# EAGLE design H&M_CD (EAGLE 9.6.0)
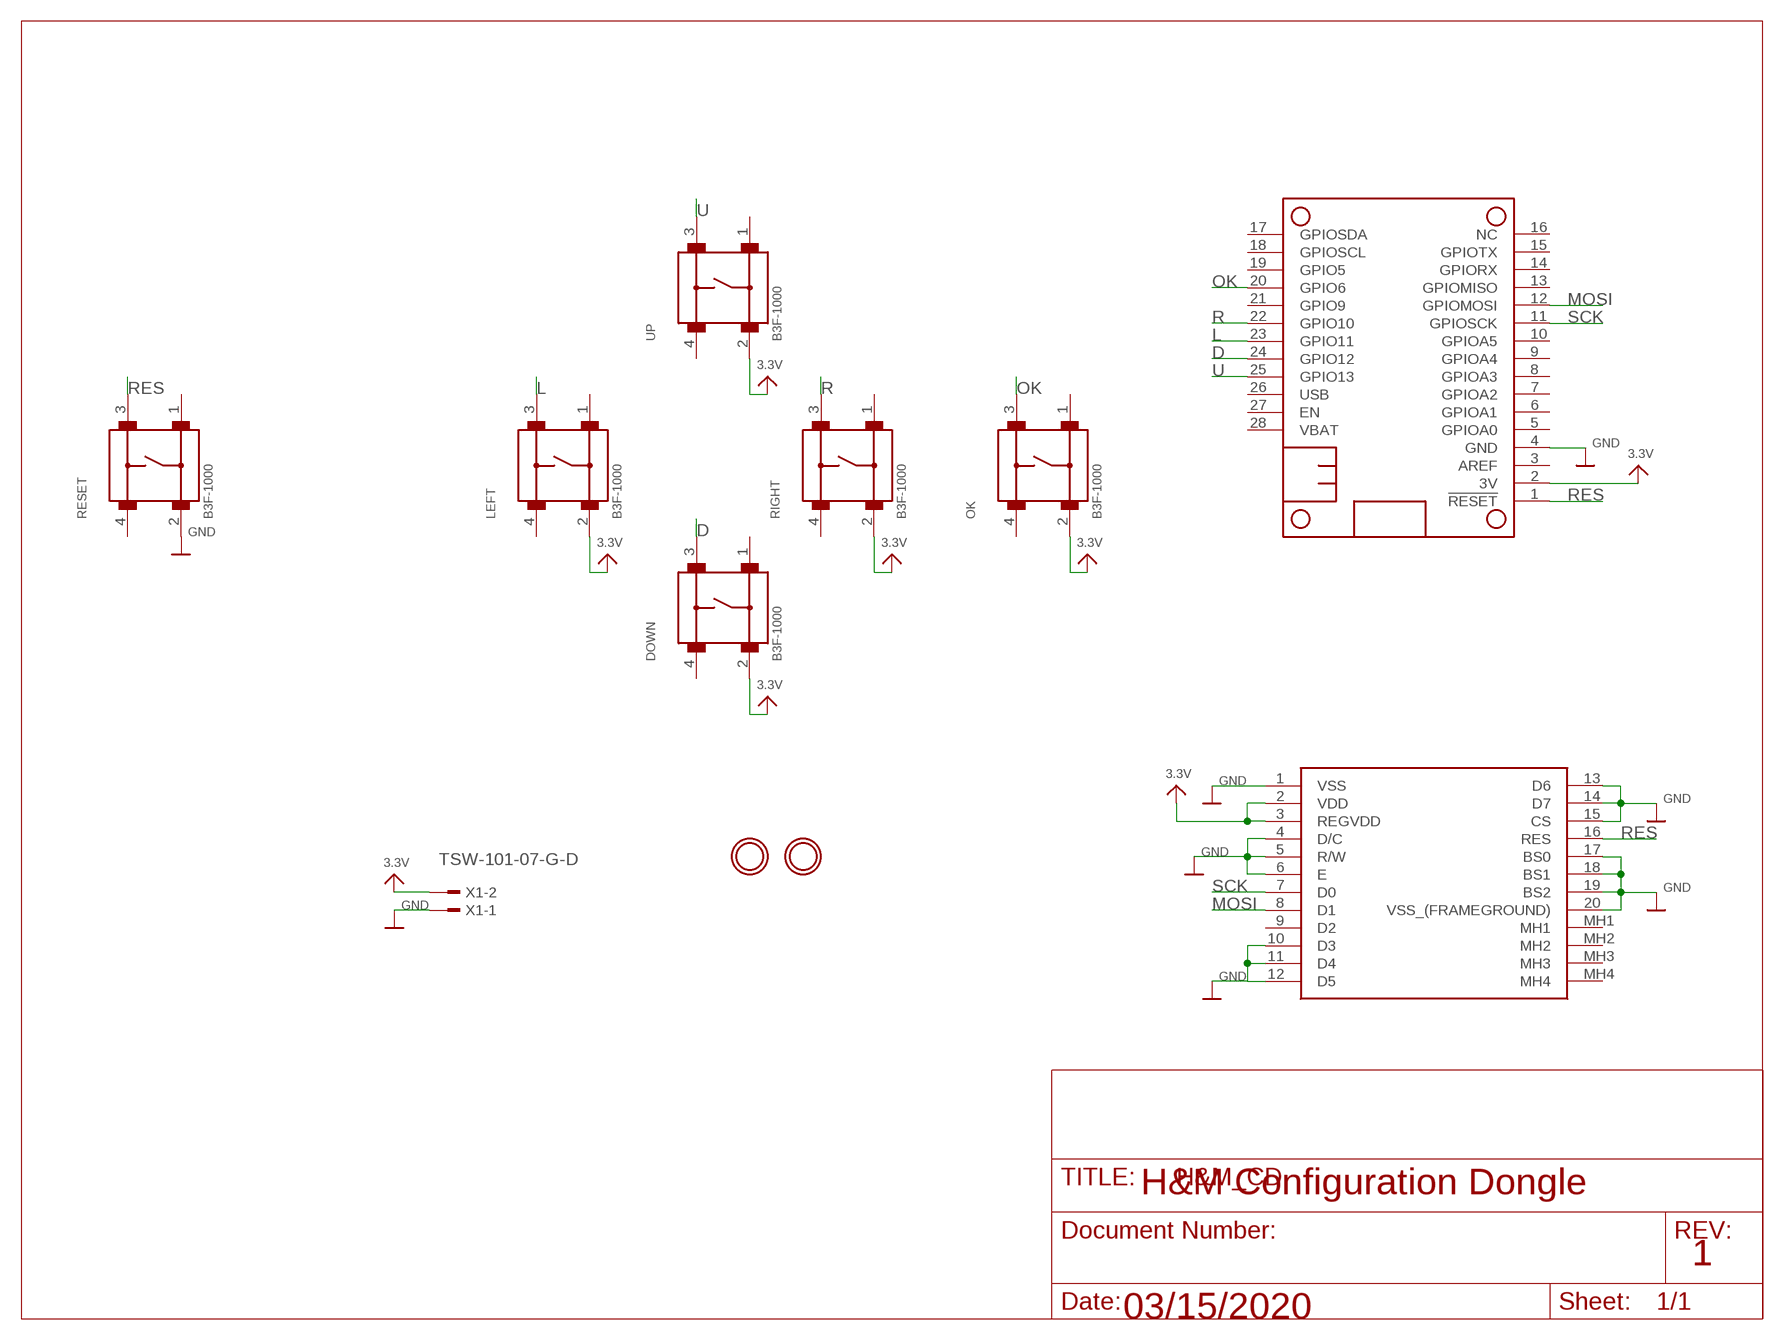
[diagram p0: schematic, sheet 1]

## Parts
20X4OLED  NHD-0420CW-AW3  [NHD0420CWAW3]
ATSAMD21M0  FEATHERWING_NODIM  [FEATHERWING_DIM]
DOWN  B3F-1000  [B3F-1000]
LEFT  B3F-1000  [B3F-1000]
OK  B3F-1000  [B3F-1000]
RESET  B3F-1000  [B3F-1000]
RIGHT  B3F-1000  [B3F-1000]
U$15  MOUNTINGHOLE2.5  [MOUNTINGHOLE_2.5_PLATED]
U$16  MOUNTINGHOLE2.5  [MOUNTINGHOLE_2.5_PLATED]
UP  B3F-1000  [B3F-1000]
X1  TSW-101-07-G-D  [TSW-101-XX-G-D]

## Nets
3.3V: 20X4OLED.2(VDD) 20X4OLED.3(REGVDD) ATSAMD21M0.2(3V) DOWN.2 LEFT.2 OK.2 RIGHT.2 UP.2 X1.2
D: ATSAMD21M0.24(GPIO12) DOWN.3
GND: 20X4OLED.1(VSS) 20X4OLED.4(D/C) 20X4OLED.5(R/W) 20X4OLED.6(E) 20X4OLED.10(D3) 20X4OLED.11(D4) 20X4OLED.12(D5) 20X4OLED.13(D6) 20X4OLED.14(D7) 20X4OLED.15(CS) 20X4OLED.17(BS0) 20X4OLED.18(BS1) 20X4OLED.19(BS2) 20X4OLED.20(VSS_(FRAMEGROUND)) ATSAMD21M0.4(GND) RESET.2 X1.1
L: ATSAMD21M0.23(GPIO11) LEFT.3
MOSI: 20X4OLED.8(D1) ATSAMD21M0.12(GPIOMOSI)
OK: ATSAMD21M0.20(GPIO6) OK.3
R: ATSAMD21M0.22(GPIO10) RIGHT.3
RES: 20X4OLED.16(RES) ATSAMD21M0.1(!RESET) RESET.3
SCK: 20X4OLED.7(D0) ATSAMD21M0.11(GPIOSCK)
U: ATSAMD21M0.25(GPIO13) UP.3
Unconnected: 20X4OLED.9(D2) 20X4OLED.MH1 20X4OLED.MH2 20X4OLED.MH3 20X4OLED.MH4 ATSAMD21M0.3(AREF) ATSAMD21M0.5(GPIOA0) ATSAMD21M0.6(GPIOA1) ATSAMD21M0.7(GPIOA2) ATSAMD21M0.8(GPIOA3) ATSAMD21M0.9(GPIOA4) ATSAMD21M0.10(GPIOA5) ATSAMD21M0.13(GPIOMISO) ATSAMD21M0.14(GPIORX) ATSAMD21M0.15(GPIOTX) ATSAMD21M0.16(NC) ATSAMD21M0.17(GPIOSDA) ATSAMD21M0.18(GPIOSCL) ATSAMD21M0.19(GPIO5) ATSAMD21M0.21(GPIO9) ATSAMD21M0.26(USB) ATSAMD21M0.27(EN) ATSAMD21M0.28(VBAT) DOWN.1 DOWN.4 LEFT.1 LEFT.4 OK.1 OK.4 RESET.1 RESET.4 RIGHT.1 RIGHT.4 UP.1 UP.4

## Notes on the sheet
- H&M Configuration Dongle
- 1
- 03/15/2020

## Library data of the parts
20X4OLED = SamacSys_Parts:NHD-0420CW-AW3: OLED Displays & Accessories 4x20 White Slim Character OLED Source: Datasheet <https://componentsearchengine.com/Datasheets/1/NHD-0420CW-AW3.pdf>; DESCRIPTION: OLED Displays & Accessories 4x20 White Slim Character OLED; HEIGHT: 7mm; MANUFACTURER_NAME: Newhaven Display; MANUFACTURER_PART_NUMBER: NHD-0420CW-AW3; MOUSER_PART_NUMBER: 763-NHD-0420CW-AW3; MOUSER_PRICE-STOCK: https://www.mouser.com/Search/Refine.aspx?Keyword=763-NHD-0420CW-AW3
ATSAMD21M0 = adafruit:FEATHERWING
DOWN LEFT OK RESET RIGHT UP = Switch:B3F-1000: Tactile Switch SPST-NO Top Actuated Through Hole Manufacturer's datasheet <https://omronfs.omron.com/en_US/ecb/products/pdf/en-b3f.pdf>; CREATED_BY: PCBLayout.com; DIGI_KEY_PART_NUMBER: SW400-ND; MANUFACTURER: Omron Electronics Inc-EMC Div; MPN: B3F-1000; PACKAGE: SPST-NO
U$15 U$16 = microbuilder:MOUNTINGHOLE: Mounting Hole For #2 screws (0.086"/2.18mm width, 0.094"/2.4mm hole) use 2.5mm
X1 = con-samtec:TSW-101-*-G: THROUGH-HOLE .025" SQ POST HEADER Source: Samtec TSW.pdf; MF: Samtec Inc.; MPN: TSW-101-07-G-D

## Board
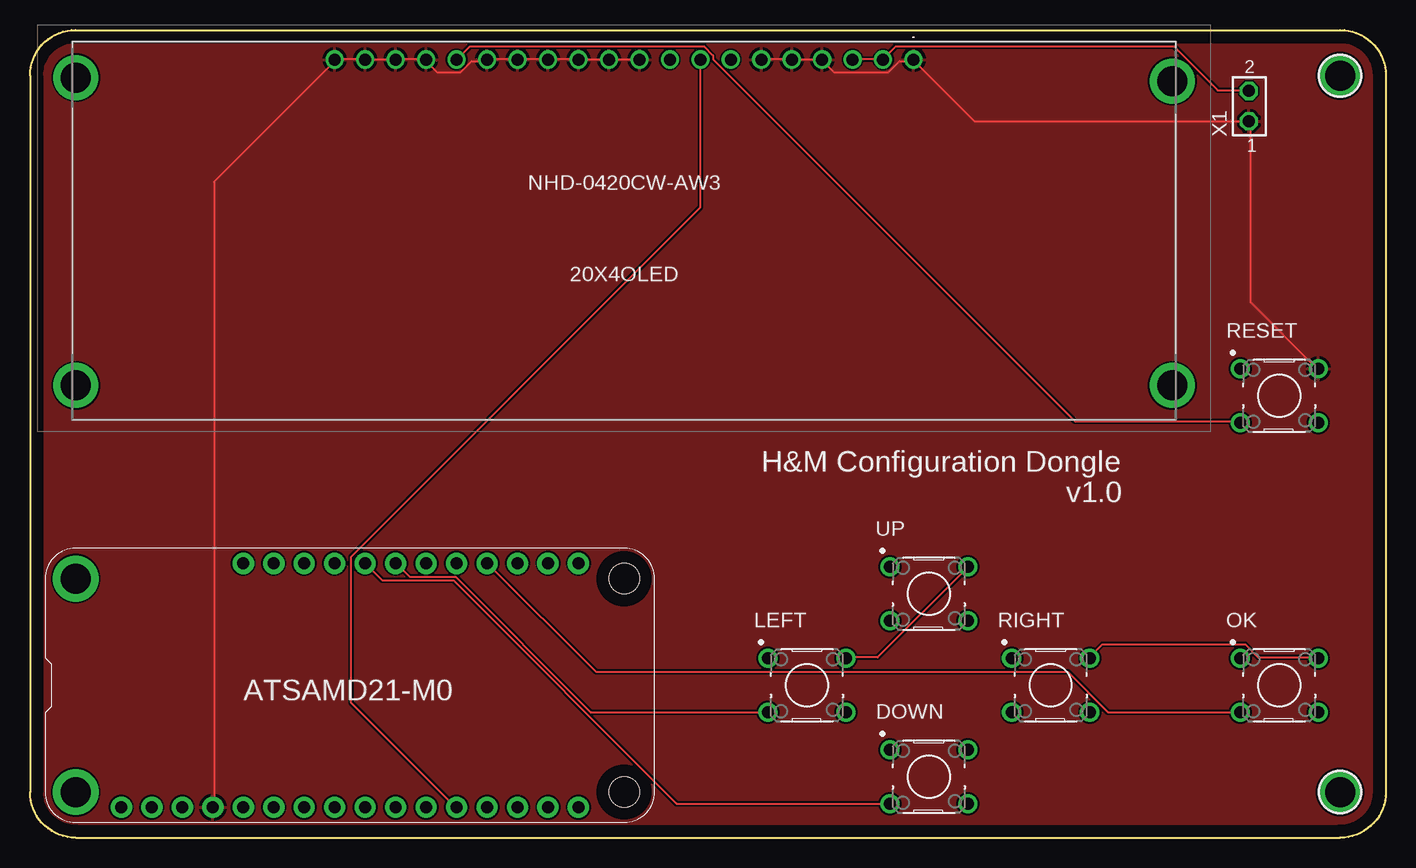
[diagram p1: board, top side]
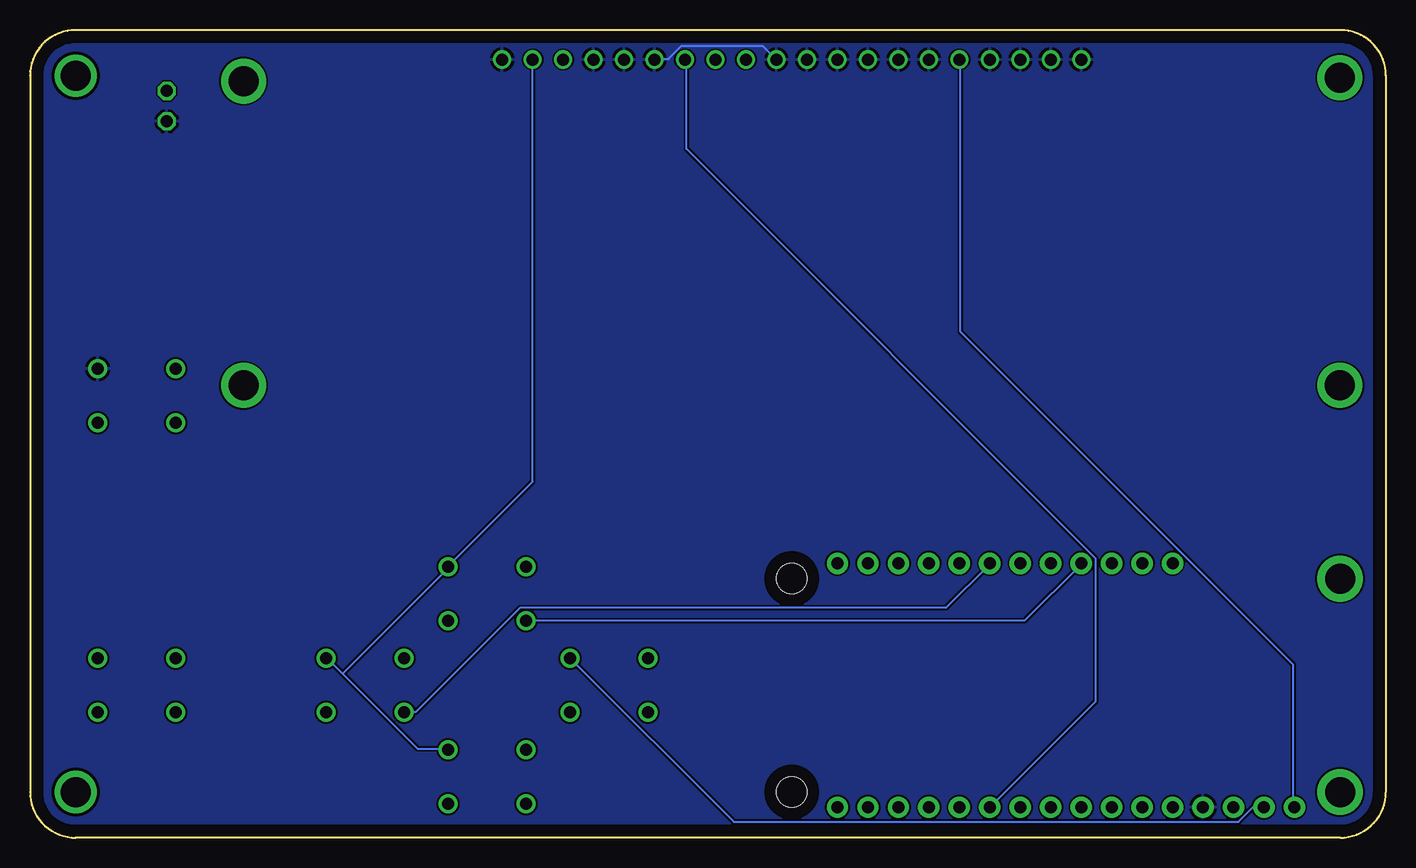
[diagram p2: board, bottom side, seen from below]

Size 113.03 x 67.31 mm. Coordinates in mm from the lower left corner, seen from the top.
Outline: 3.81,67.31 109.22,67.31 arc-90 113.03,63.5 113.03,3.81 arc-90 109.22,0 3.81,0 arc-90 0,3.81 0,63.5 arc-90 3.81,67.31
Copper layers (1*16): Top 0.035mm / dielectric 1.5mm / Bottom 0.035mm
Design rules "default": minimum track width 6mil, minimum drill 0.35mm, track to track 6mil, track to pad 6mil, pad to pad 6mil, via to via 6mil, smd to smd 6mil, copper to edge 40mil, drill to drill 6mil, minimum pad ring 10mil, minimum via ring 8mil, stop-mask expansion 4mil, vias tented up to drill 0mil, thermal gap 10mil

### Footprints (pad centres in the part's own frame; a part is rotated, then mirrored left to right if it is on the bottom)
NHD0420CWAW3 = drill 1 pad 1.5: 1 24.13,14.05; 2 21.59,14.05; 3 19.05,14.05; 4 16.51,14.05; 5 13.97,14.05; 6 11.43,14.05; 7 8.89,14.05; 8 6.35,14.05; 9 3.81,14.05; 10 1.27,14.05; 11 -1.27,14.05; 12 -3.81,14.05; 13 -6.35,14.05; 14 -8.89,14.05; 15 -11.43,14.05; 16 -13.97,14.05; 17 -16.51,14.05; 18 -19.05,14.05; 19 -21.59,14.05; 20 -24.13,14.05 | drill 2.5 pad 3.75: MH1 -45.7,12.55; MH2 -45.7,-13.11; MH3 45.7,-13.11; MH4 45.7,12.25
FEATHERWING_DIM = drill 1 pad 1.778: 1 6.35,1.27; 2 8.89,1.27; 3 11.43,1.27; 4 13.97,1.27; 5 16.51,1.27; 6 19.05,1.27; 7 21.59,1.27; 8 24.13,1.27; 9 26.67,1.27; 10 29.21,1.27; 11 31.75,1.27; 12 34.29,1.27; 13 36.83,1.27; 14 39.37,1.27; 15 41.91,1.27; 16 44.45,1.27; 17 44.45,21.59; 18 41.91,21.59; 19 39.37,21.59; 20 36.83,21.59; 21 34.29,21.59; 22 31.75,21.59; 23 29.21,21.59; 24 26.67,21.59; 25 24.13,21.59; 26 21.59,21.59; 27 19.05,21.59; 28 16.51,21.59 | drill 2.5 pad 3.81: P$1 2.54,20.32; P$2 2.54,2.54 | hole 2.54: 48.26,20.32; 48.26,2.54
B3F-1000 = drill 1 pad 1.6: 1 -3.25,2.25; 2 3.25,2.25; 3 -3.25,-2.25; 4 3.25,-2.25
MOUNTINGHOLE_2.5_PLATED = drill 2.5 pad 3.2: P$1 0,0
TSW-101-XX-G-D = drill 1 pad 1.5 octagon: 1 0.02,-1.27; 2 0.02,1.27

### Placement (x,y rotation side)
20X4OLED  49.53,50.8 0 top
ATSAMD21M0  1.27,1.27 0 top
DOWN  74.93,5.08 0 top
LEFT  64.77,12.7 0 top
OK  104.14,12.7 0 top
RESET  104.14,36.83 0 top
RIGHT  85.09,12.7 0 top
U$15  109.22,3.81 0 top
U$16  109.22,63.5 0 top
UP  74.93,20.32 0 top
X1  101.6,60.96 0 top

### Tracks (layer width: path | path; a pad name or v marks a point on that pad's centre or on a via)
3.3V
  Top 0.152: OK.2 107.24,15.04 102.36,15.04 101.3,16.1 89.41,16.1 88.34,15.04 RIGHT.2 | 71.12,64.87 68.68,64.87 20X4OLED.3 | 71.12,64.87 72.19,65.94 95.35,65.94 99.01,62.28 101.6,62.28 X1.2 | 71.12,64.87 20X4OLED.2 | LEFT.2 68.07,15.04 70.66,15.04 78.13,22.5 UP.2
  Bottom 0.152: 86.97,13.66 88.19,14.88 RIGHT.2 | 86.97,13.66 80.72,7.42 78.28,7.42 DOWN.2 | ATSAMD21M0.2 11.07,2.54 12.29,1.32 54.36,1.32 67.92,14.88 LEFT.2 | 20X4OLED.2 71.12,29.67 78.13,22.66 UP.2 78.13,22.5 86.97,13.66
D
  Top 0.152: ATSAMD21M0.24 29.36,21.44 35.31,21.44 53.9,2.85 71.58,2.85 DOWN.3
GND
  Top 0.152: RESET.2 107.24,39.12 101.75,44.6 101.75,59.69 X1.1 78.74,59.69 73.71,64.72 20X4OLED.1 73.56,64.72 72.49,64.72 71.58,63.8 67.01,63.8 66.09,64.72 20X4OLED.4 65.94,64.87 63.5,64.87 | 63.5,64.87 61.06,64.87 20X4OLED.6 | 63.5,64.87 20X4OLED.5 | 40.64,64.87 38.2,64.87 20X4OLED.15 38.05,64.72 36.83,64.72 35.92,63.8 33.93,63.8 33.02,64.72 20X4OLED.17 33.02,64.87 30.58,64.87 20X4OLED.18 30.43,64.87 27.99,64.87 20X4OLED.19 27.84,64.87 25.4,64.87 20X4OLED.20 25.4,64.72 15.34,54.66 15.34,2.54 ATSAMD21M0.4 | 48.26,64.87 45.82,64.87 20X4OLED.12 45.67,64.87 43.23,64.87 20X4OLED.13 43.08,64.87 40.64,64.87 | 48.26,64.87 50.7,64.87 20X4OLED.10 | 48.26,64.87 20X4OLED.11 | 40.64,64.87 20X4OLED.14
  Bottom 0.152: 20X4OLED.6 60.91,64.87 59.84,64.87 58.78,65.94 51.92,65.94 50.85,64.87 20X4OLED.10
  pour Bottom: 0,63.5 0,3.81 arc90 3.81,0 109.22,0 arc90 113.03,3.81 113.03,63.5 arc90 109.22,67.31 3.81,67.31 arc90
  pour Top: 0,63.5 0,3.81 arc90 3.81,0 109.22,0 arc90 113.03,3.81 113.03,63.5 arc90 109.22,67.31 3.81,67.31 arc90
L
  Top 0.152: LEFT.3 61.52,10.46 46.74,10.46 35.46,21.74 31.65,21.74 30.58,22.81 ATSAMD21M0.23
MOSI
  Top 0.152: 20X4OLED.8 55.88,52.53 26.77,23.42 26.77,11.23 35.46,2.54 ATSAMD21M0.12
OK
  Top 0.152: OK.3 100.84,10.46 89.87,10.46 86.51,13.82 47.19,13.82 38.2,22.81 ATSAMD21M0.20
R
  Bottom 0.152: RIGHT.3 81.79,10.46 80.87,10.46 72.19,19.15 36.68,19.15 33.02,22.81 ATSAMD21M0.22
RES
  Top 0.152: RESET.3 100.84,34.7 87.12,34.7 56.95,64.87 56.95,65.18 56.19,65.94 36.68,65.94 35.61,64.87 20X4OLED.16
  Bottom 0.152: 20X4OLED.16 35.46,64.72 35.46,42.16 7.72,14.43 7.72,2.54 ATSAMD21M0.1
SCK
  Bottom 0.152: ATSAMD21M0.11 24.18,11.38 24.18,23.27 58.32,57.4 58.32,64.72 20X4OLED.7
U
  Bottom 0.152: UP.3 71.58,18.09 30.12,18.09 25.4,22.81 ATSAMD21M0.25
(copper drawn outside any net)
  shapes: Top area x2

### Text on the board
tPlace: H&M Configuration Dongle
tNames: v1.0